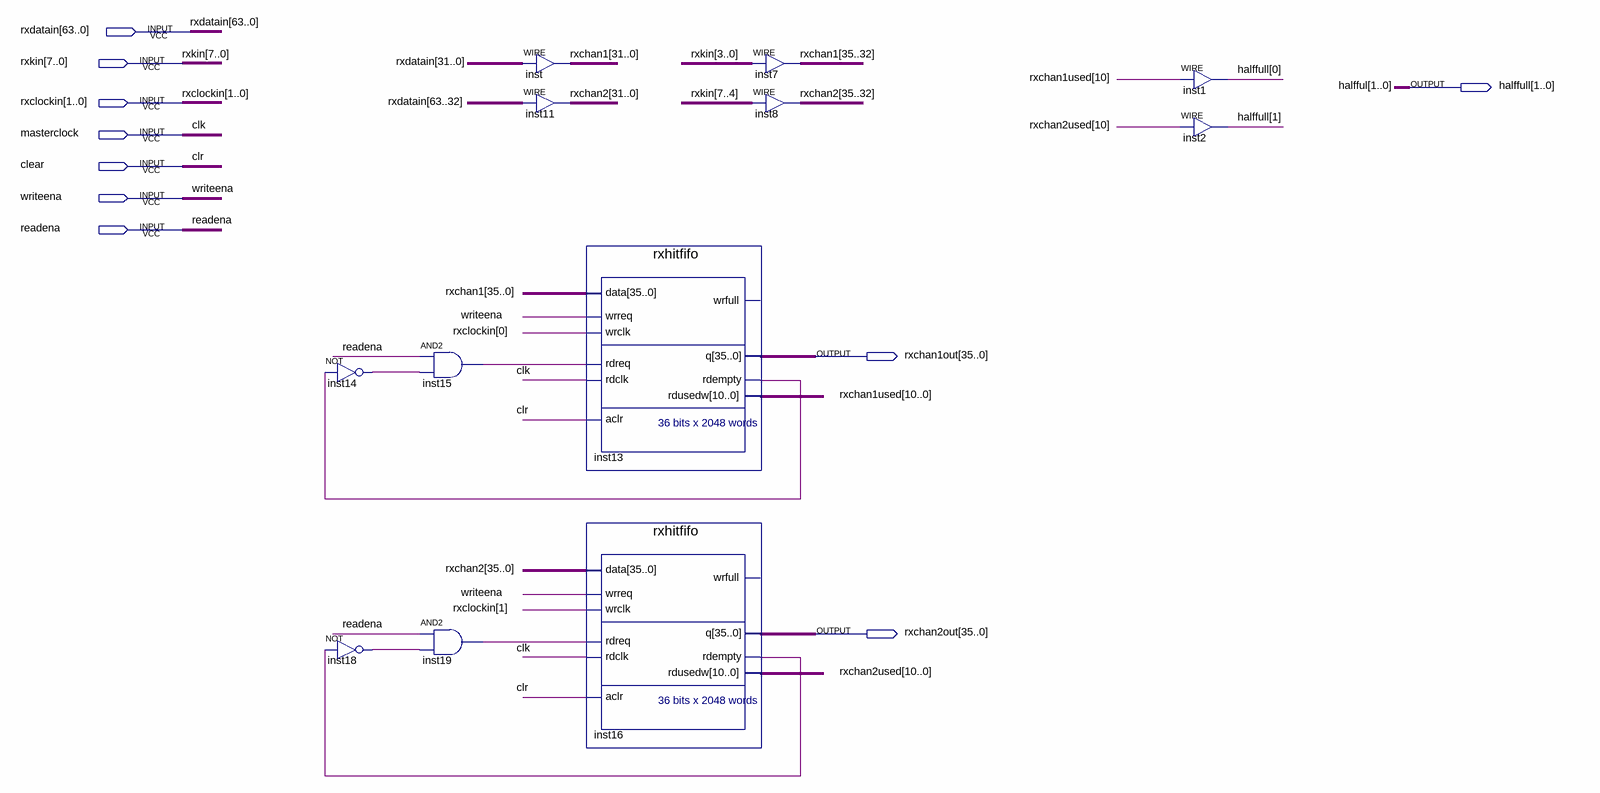
[diagram p0: schematic sheet]
// Quartus schematic TwoChanHitFIFOs.bdf as structural Verilog: 12 symbols, 10 pins
module TwoChanHitFIFOs (
  input  [63:0] rxdatain,
  input  [7:0] rxkin,
  input  [1:0] rxclockin,
  input  masterclock,
  input  clear,
  input  writeena,
  input  readena,
  output [1:0] halffull,
  output [35:0] rxchan1out,
  output [35:0] rxchan2out
);

  wire inst13_rdempty, inst14_out, inst15_out, inst16_rdempty, inst18_out, inst19_out;
  wire [10:0] rxchan1used, rxchan2used;
  wire [35:0] rxchan1, rxchan2;

  not inst14 (inst14_out, inst13_rdempty);
  not inst18 (inst18_out, inst16_rdempty);
  and inst15 (inst15_out, readena, inst14_out);
  and inst19 (inst19_out, readena, inst18_out);
  assign rxchan1[31:0] = rxdatain[31:0];  // WIRE inst
  assign rxchan2[31:0] = rxdatain[63:32];  // WIRE inst11
  rxhitfifo inst13 (
    .data(rxchan1), .wrreq(writeena), .wrclk(rxclockin[0]), .rdreq(inst15_out), .rdclk(masterclock),
    .aclr(clear), .q(rxchan1out), .rdempty(inst13_rdempty), .rdusedw(rxchan1used));  // open: wrfull
  rxhitfifo inst16 (
    .data(rxchan2), .wrreq(writeena), .wrclk(rxclockin[1]), .rdreq(inst19_out), .rdclk(masterclock),
    .aclr(clear), .q(rxchan2out), .rdempty(inst16_rdempty), .rdusedw(rxchan2used));  // open: wrfull
  assign rxchan1[35:32] = rxkin[3:0];  // WIRE inst7
  assign rxchan2[35:32] = rxkin[7:4];  // WIRE inst8
  assign halffull[0] = rxchan1used[10];  // WIRE inst1
  assign halffull[1] = rxchan2used[10];  // WIRE inst2

  // Other names for the same wires on the sheet: clk = masterclock; clr = clear; halfful[1:0] = halffull
endmodule
